# EAGLE schematic cpu (EAGLE 7.6.0)
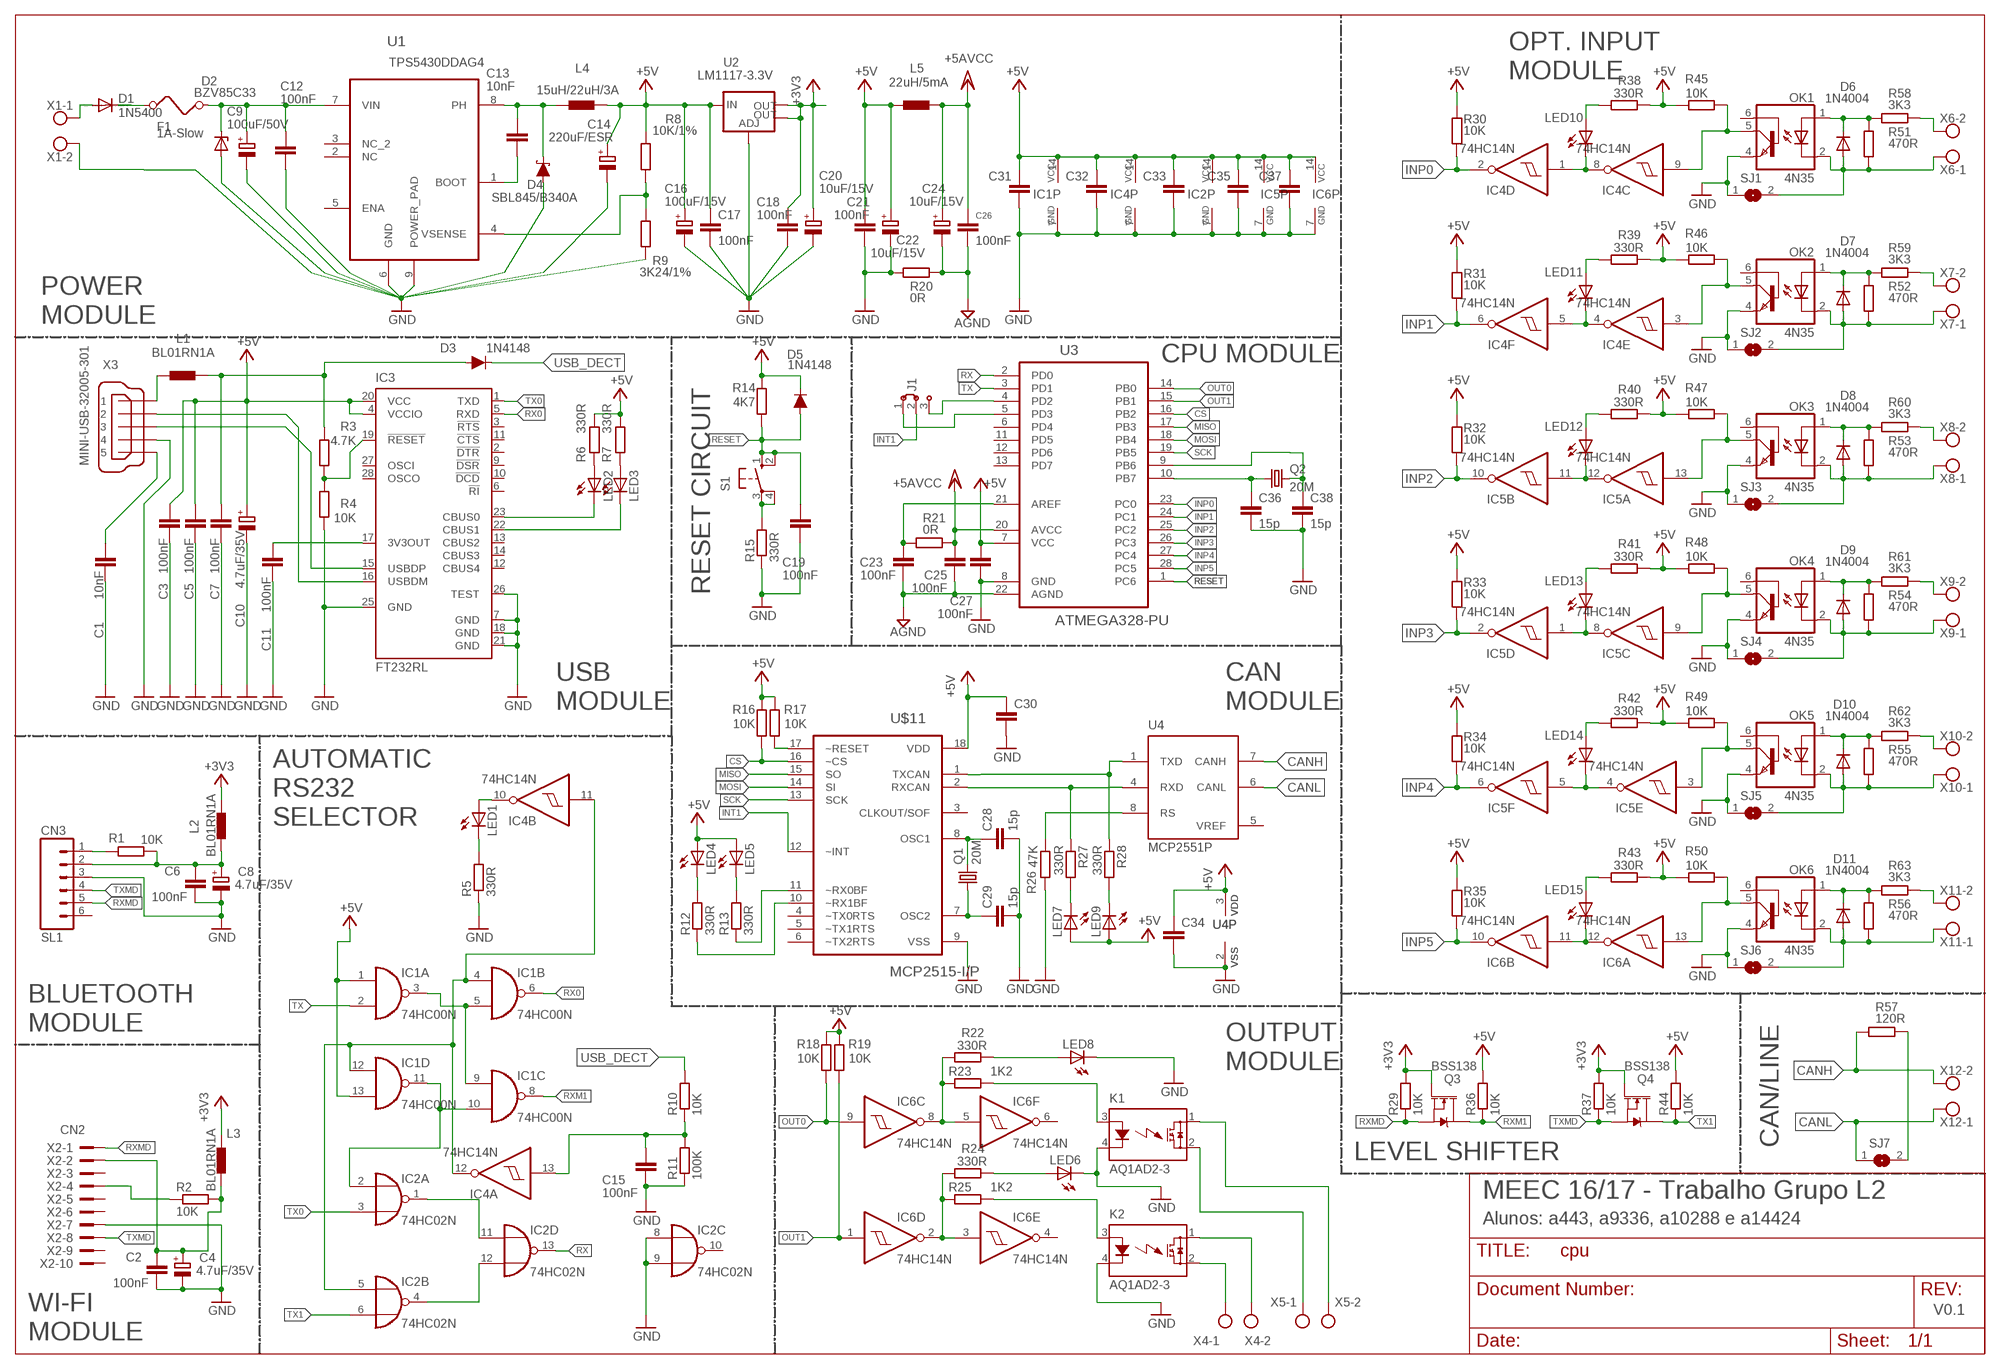
[diagram p0: schematic, sheet 1]

## Parts
C1  10nF  C-EUC0805  [C0805]
C2  100nF  C-EUC0805  [C0805]
C3  100nF  C-EUC0805  [C0805]
C4  4.7uF/35V  CPOL-EUE5-10.5  [E5-10,5]
C5  100nF  C-EUC0805  [C0805]
C6  100nF  C-EUC0805  [C0805]
C7  100nF  C-EUC0805  [C0805]
C8  4.7uF/35V  CPOL-EUE5-10.5  [E5-10,5]
C9  100uF/50V  CPOL-EUE5-10.5  [E5-10,5]
C10  4.7uF/35V  CPOL-EUE5-10.5  [E5-10,5]
C11  100nF  C-EUC0805  [C0805]
C12  100nF  C-EUC0805  [C0805]
C13  10nF  C-EUC0805  [C0805]
C14  220uF/ESR  CPOL-EUE5-10.5  [E5-10,5]
C15  100nF  C-EUC0805  [C0805]
C16  100uF/15V  CPOL-EUE5-10.5  [E5-10,5]
C17  100nF  C-EUC0805  [C0805]
C18  100nF  C-EUC0805  [C0805]
C19  100nF  C-EUC0805  [C0805]
C20  10uF/15V  CPOL-EUE5-10.5  [E5-10,5]
C21  100nF  C-EUC0805  [C0805]
C22  10uF/15V  CPOL-EUE5-10.5  [E5-10,5]
C23  100nF  C-EUC0805  [C0805]
C24  10uF/15V  CPOL-EUE5-10.5  [E5-10,5]
C25  100nF  C-EUC0805  [C0805]
C26  100nF  C-EUC0805  [C0805]
C27  100nF  C-EUC0805  [C0805]
C28  15p  C-EU025-024X044  [C025-024X044]
C29  15p  C-EU025-024X044  [C025-024X044]
C30  C-EUC0805  [C0805]
C31  C-EUC0805  [C0805]
C32  C-EUC0805  [C0805]
C33  C-EUC0805  [C0805]
C34  C-EUC0805  [C0805]
C35  C-EUC0805  [C0805]
C36  15p  C-EU025-024X044  [C025-024X044]
C37  C-EUC0805  [C0805]
C38  15p  C-EU025-024X044  [C025-024X044]
D1  1N5400  [DO201-15]
D2  BZV85C33  ZENER-DIODEF126-10  [F126Z10]
D3  1N4148  DIODE-1N4148  [DIODE-1N4148]
D4  SBL845/B340A  DIODE-SCHOTTKY-B340A  [SMA-DIODE]
D5  1N4148  DIODE-1N4148  [DIODE-1N4148]
D6  1N4004  [DO41-10]
D7  1N4004  [DO41-10]
D8  1N4004  [DO41-10]
D9  1N4004  [DO41-10]
D10  1N4004  [DO41-10]
D11  1N4004  [DO41-10]
F1  1A-Slow  FUSE  [FUSE]
IC1  74HC00N  [DIL14]
IC2  74HC02N  [DIL14]
IC3  FT232RL  [SSOP28]
IC4  74HC14N  [DIL14]
IC5  74HC14N  [DIL14]
IC6  74HC14N  [DIL14]
J1  J2X2MM  [04C]
K1  AQ1AD2-3  [AQ1]
K2  AQ1AD2-3  [AQ1]
L1  BL01RN1A  [BL01RN1A]
L2  BL01RN1A  [BL01RN1A]
L3  BL01RN1A  [BL01RN1A]
L4  15uH/22uH/3A  DR1030  [DR1030]
L5  22uH/5mA  BL01RN1A  [BL01RN1A]
LED1  LED3MM  [LED3MM]
LED2  LED3MM  [LED3MM]
LED3  LED3MM  [LED3MM]
LED4  LED3MM  [LED3MM]
LED5  LED3MM  [LED3MM]
LED6  LED3MM  [LED3MM]
LED7  LED3MM  [LED3MM]
LED8  LED3MM  [LED3MM]
LED9  LED3MM  [LED3MM]
LED10  LED3MM  [LED3MM]
LED11  LED3MM  [LED3MM]
LED12  LED3MM  [LED3MM]
LED13  LED3MM  [LED3MM]
LED14  LED3MM  [LED3MM]
LED15  LED3MM  [LED3MM]
OK1  4N35  [DIL06]
OK2  4N35  [DIL06]
OK3  4N35  [DIL06]
OK4  4N35  [DIL06]
OK5  4N35  [DIL06]
OK6  4N35  [DIL06]
Q1  20M  CRYSTALHC49S  [HC49/S]
Q2  20M  CRYSTALHC49S  [HC49/S]
Q3  BSS138  MOSFET-NCH-BSS138  [SOT23-3]
Q4  BSS138  MOSFET-NCH-BSS138  [SOT23-3]
R1  10K  R-EU_R0603  [R0603]
R2  10K  R-EU_R0603  [R0603]
R3  4.7K  R-EU_R0603  [R0603]
R4  10K  R-EU_R0603  [R0603]
R5  330R  R-EU_R0603  [R0603]
R6  330R  R-EU_R0603  [R0603]
R7  330R  R-EU_R0603  [R0603]
R8  10K/1%  R-EU_R0603  [R0603]
R9  3K24/1%  R-EU_R0603  [R0603]
R10  10K  R-EU_R0603  [R0603]
R11  100K  R-EU_R0603  [R0603]
R12  330R  R-EU_R0603  [R0603]
R13  330R  R-EU_R0603  [R0603]
R14  4K7  R-EU_R0603  [R0603]
R15  330R  R-EU_R0603  [R0603]
R16  10K  R-EU_R0603  [R0603]
R17  10K  R-EU_R0603  [R0603]
R18  10K  R-EU_R0603  [R0603]
R19  10K  R-EU_R0603  [R0603]
R20  0R  R-EU_R0603  [R0603]
R21  0R  R-EU_R0603  [R0603]
R22  330R  R-EU_R0603  [R0603]
R23  1K2  R-EU_R0603  [R0603]
R24  330R  R-EU_R0603  [R0603]
R25  1K2  R-EU_R0603  [R0603]
R26  47K  R-EU_R0603  [R0603]
R27  330R  R-EU_R0603  [R0603]
R28  330R  R-EU_R0603  [R0603]
R29  10K  R-EU_R0603  [R0603]
R30  10K  R-EU_R0603  [R0603]
R31  10K  R-EU_R0603  [R0603]
R32  10K  R-EU_R0603  [R0603]
R33  10K  R-EU_R0603  [R0603]
R34  10K  R-EU_R0603  [R0603]
R35  10K  R-EU_R0603  [R0603]
R36  10K  R-EU_R0603  [R0603]
R37  10K  R-EU_R0603  [R0603]
R38  330R  R-EU_R0603  [R0603]
R39  330R  R-EU_R0603  [R0603]
R40  330R  R-EU_R0603  [R0603]
R41  330R  R-EU_R0603  [R0603]
R42  330R  R-EU_R0603  [R0603]
R43  330R  R-EU_R0603  [R0603]
R44  10K  R-EU_R0603  [R0603]
R45  10K  R-EU_R0603  [R0603]
R46  10K  R-EU_R0603  [R0603]
R47  10K  R-EU_R0603  [R0603]
R48  10K  R-EU_R0603  [R0603]
R49  10K  R-EU_R0603  [R0603]
R50  10K  R-EU_R0603  [R0603]
R51  470R  R-EU_R0603  [R0603]
R52  470R  R-EU_R0603  [R0603]
R53  470R  R-EU_R0603  [R0603]
R54  470R  R-EU_R0603  [R0603]
R55  470R  R-EU_R0603  [R0603]
R56  470R  R-EU_R0603  [R0603]
R57  120R  R-EU_R0603  [R0603]
R58  3K3  R-EU_R0603  [R0603]
R59  3K3  R-EU_R0603  [R0603]
R60  3K3  R-EU_R0603  [R0603]
R61  3K3  R-EU_R0603  [R0603]
R62  3K3  R-EU_R0603  [R0603]
R63  3K3  R-EU_R0603  [R0603]
S1  10-XX  [B3F-10XX]
SJ1  SJ  [SJ]
SJ2  SJ  [SJ]
SJ3  SJ  [SJ]
SJ4  SJ  [SJ]
SJ5  SJ  [SJ]
SJ6  SJ  [SJ]
SJ7  SJ  [SJ]
SL1  CN3  M06  [06P]
U1  TPS5430DDAG4  [SOIC127P600X170-9N]
U2  LM1117-3.3V  V_REG_LM1117SOT223  [SOT223]
U3  ATMEGA328-PU  [DIP254P762X406-28P]
U4  MCP2551P  [DIL8]
U$11  MCP2515-I/P  [DIP254P762X432-18]
X1  AK300/2  [AK300/2]
X2  CN2  2510-  [PAK100/2500-10]
X3  MINI-USB-32005-301  [32005-301]
X4  AK300/2  [AK300/2]
X5  AK300/2  [AK300/2]
X6  AK300/2  [AK300/2]
X7  AK300/2  [AK300/2]
X8  AK300/2  [AK300/2]
X9  AK300/2  [AK300/2]
X10  AK300/2  [AK300/2]
X11  AK300/2  [AK300/2]
X12  AK300/2  [AK300/2]

## Nets
+3V3: C18.1 C20.+ L2.2 L3.2 Q3.1(G) Q4.1(G) R29.2 R37.2 U2.2(OUT) U2.4(OUT)
+5V: C3.1 C5.1 C10.+ C14.+ C16.+ C17.1 C21.1 C22.+ C27.1 C30.1 C31.1 C32.1 C33.1 C34.1 C35.1 C37.1 D5.C IC1.1(A:I0) IC1.13(D:I1) IC1.14(P:VCC) IC2.14(P:VCC) IC3.4(VCCIO) IC3.20(VCC) IC4.14(P:VCC) IC5.14(P:VCC) IC6.14(P:VCC) L4.2 L5.1 LED4.A LED5.A LED7.A LED9.A R6.2 R7.2 R8.1 R14.2 R16.2 R17.2 R18.2 R19.2 R30.1 R31.1 R32.1 R33.1 R34.1 R35.1 R36.2 R38.1 R39.1 R40.1 R41.1 R42.1 R43.1 R44.2 R45.1 R46.1 R47.1 R48.1 R49.1 R50.1 U2.3(IN) U3.7(VCC) U4.3(VDD) U$11.18(VDD)
AGND: C23.2 C24.- C25.2 C26.2 R20.2 U3.22(AGND)
AVCC: C25.1 R21.2 U3.20(AVCC) ; supply symbol labelled +5AVCC
CANH: R57.1 U4.7(CANH) X12.2
CANL: SJ7.1 U4.6(CANL) X12.1
CS: R16.1 U3.16(PB2) U$11.16(~CS)
GND: C1.2 C2.2 C3.2 C4.- C5.2 C6.2 C7.2 C8.- C9.- C10.- C11.2 C12.2 C14.- C15.2 C16.- C17.2 C18.2 C19.2 C20.- C21.2 C22.- C27.2 C28.2 C29.2 C30.2 C31.2 C32.2 C33.2 C34.2 C35.2 C36.2 C37.2 C38.2 D2.A D4.A IC1.7(P:GND) IC2.7(P:GND) IC2.8(C:I0) IC2.9(C:I1) IC3.7(GND) IC3.18(GND) IC3.21(GND) IC3.25(GND) IC3.26(TEST) IC4.7(P:GND) IC5.7(P:GND) IC6.7(P:GND) K1.4(K) K2.4(K) LED6.K(C) LED8.K(C) OK1.4(EMI) OK2.4(EMI) OK3.4(EMI) OK4.4(EMI) OK5.4(EMI) OK6.4(EMI) R4.1 R5.1 R9.2 R11.1 R15.1 R20.1 R26.2 SJ1.1 SJ2.1 SJ3.1 SJ4.1 SJ5.1 SJ6.1 SL1.3 U1.6(GND) U1.9(POWER_PAD) U2.1(ADJ) U3.8(GND) U4.2(VSS) U$11.9(VSS) X1.2 X2.7 X3.4
INP0: IC4.2(D:O) R30.2 U3.23(PC0)
INP1: IC4.6(F:O) R31.2 U3.24(PC1)
INP2: IC5.10(B:O) R32.2 U3.25(PC2)
INP3: IC5.2(D:O) R33.2 U3.26(PC3)
INP4: IC5.6(F:O) R34.2 U3.27(PC4)
INP5: IC6.10(B:O) R35.2 U3.28(PC5)
INT1: J1.2 U$11.12(~INT)
MISO: U3.17(PB3) U$11.15(SO)
MOSI: U3.18(PB4) U$11.14(SI)
N$1: C9.+ C12.1 D2.C F1.2 U1.7(VIN)
N$2: D1.C F1.1
N$3: C13.1 D4.C L4.1 U1.8(PH)
N$4: C13.2 U1.1(BOOT)
N$5: C36.1 Q2.1 U3.10(PB7)
N$6: C11.1 IC3.17(3V3OUT)
N$7: R8.2 R9.1 U1.4(VSENSE)
N$8: C15.1 IC4.13(A:I) R10.1 R11.2
N$9: IC3.15(USBDP) X3.3
N$10: LED3.A R7.1
N$11: IC3.19(!RESET) R3.1 R4.2
N$12: C7.1 D3.A L1.2 R3.2
N$13: IC3.16(USBDM) X3.2
N$14: IC2.1(A:O) IC2.11(D:I0)
N$15: L1.1 X3.1
N$16: R57.2 SJ7.2
N$17: IC4.10(B:O) LED1.A
N$18: IC2.4(B:O) IC2.12(D:I1)
N$19: IC1.3(A:O) IC1.5(B:I1) IC1.9(C:I0)
N$20: LED1.K(C) R5.2
N$21: C1.1 X3.5
N$22: LED2.A R6.1
N$23: IC1.10(C:I1) IC1.11(D:O) IC2.2(A:I0)
N$24: IC3.23(CBUS0) LED2.K(C)
N$25: IC3.22(CBUS1) LED3.K(C)
N$26: R13.1 U$11.11(~RX0BF)
N$27: C28.1 Q1.2 U$11.8(OSC1)
N$28: R2.1 X2.4
N$29: R12.1 U$11.10(~RX1BF)
N$30: R15.2 S1.3(P) S1.4(P1)
N$31: R27.1 U4.4(RXD) U$11.2(RXCAN)
N$32: J1.3 U3.4(PD2)
N$33: J1.1 U3.5(PD3)
N$34: C23.1 R21.1 U3.21(AREF)
N$35: D6.C OK1.1(A) R51.1 R58.1
N$36: R26.1 U4.8(RS)
N$37: LED11.A R39.2
N$38: R28.1 U4.1(TXD) U$11.1(TXCAN)
N$39: LED9.K(C) R28.2
N$40: LED7.K(C) R27.2
N$41: LED10.A R38.2
N$42: IC4.1(D:I) IC4.8(C:O) LED10.K(C)
N$43: IC4.4(E:O) IC4.5(F:I) LED11.K(C)
N$44: C2.1 C4.+ L3.1 R2.2 X2.2
N$45: D7.C OK2.1(A) R52.1 R59.1
N$46: IC4.3(E:I) OK2.5(COL) R46.2
N$47: R59.2 X7.2
N$48: C29.1 Q1.1 U$11.7(OSC2)
N$49: LED4.K(C) R12.2
N$50: LED5.K(C) R13.2
N$51: D7.A OK2.2(C) R52.2 SJ2.2 X7.1
N$52: IC4.9(C:I) OK1.5(COL) R45.2
N$53: IC5.4(E:O) IC5.5(F:I) LED14.K(C)
N$54: LED12.A R40.2
N$55: IC5.11(B:I) IC5.12(A:O) LED12.K(C)
N$56: C6.1 C8.+ L2.1 R1.1 SL1.2
N$57: D8.C OK3.1(A) R53.1 R60.1
N$58: IC5.13(A:I) OK3.5(COL) R47.2
N$59: R60.2 X8.2
N$60: D8.A OK3.2(C) R53.2 SJ3.2 X8.1
N$61: LED13.A R41.2
N$62: IC5.1(D:I) IC5.8(C:O) LED13.K(C)
N$63: IC6.5(F:I) IC6.8(C:O) R22.2 R23.2
N$64: D9.C OK4.1(A) R54.1 R61.1
N$65: IC5.9(C:I) OK4.5(COL) R48.2
N$66: R61.2 X9.2
N$67: D9.A OK4.2(C) R54.2 SJ4.2 X9.1
N$68: LED14.A R42.2
N$69: IC6.2(D:O) IC6.3(E:I) R24.2 R25.2
N$70: R1.2 SL1.1
N$71: D10.C OK5.1(A) R55.1 R62.1
N$72: IC5.3(E:I) OK5.5(COL) R49.2
N$73: R62.2 X10.2
N$74: D10.A OK5.2(C) R55.2 SJ5.2 X10.1
N$75: LED15.A R43.2
N$76: IC6.11(B:I) IC6.12(A:O) LED15.K(C)
N$77: K2.3(A) R25.1
N$78: D11.C OK6.1(A) R56.1 R63.1
N$79: R58.2 X6.2
N$80: D6.A OK1.2(C) R51.2 SJ1.2 X6.1
N$81: IC6.13(A:I) OK6.5(COL) R50.2
N$82: R63.2 X11.2
N$83: D11.A OK6.2(C) R56.2 SJ6.2 X11.1
N$84: IC1.4(B:I0) IC1.12(D:I0) IC2.5(B:I0) IC4.11(B:I) IC4.12(A:O)
N$85: K1.3(A) R23.1
N$86: LED8.A R22.1
N$87: D1.A X1.1
N$89: LED6.A R24.1
N$92: K2.2(DS2) X4.1
N$93: K2.1(DS1) X4.2
N$94: K1.2(DS2) X5.1
N$95: K1.1(DS1) X5.2
OUT0: IC6.9(C:I) R18.1 U3.14(PB0)
OUT1: IC6.1(D:I) R19.1 U3.15(PB1)
RESET: C19.1 D5.A R14.1 S1.1(S) S1.2(S1) U3.1(PC6)
RESET1: R17.1 U$11.17(~RESET)
RX: IC2.13(D:O) U3.2(PD0)
RX0: IC1.6(B:O) IC3.5(RXD)
RXM1: IC1.8(C:O) Q3.3(D) R36.1
RXMD: Q3.2(S) R29.1 SL1.5 X2.1
SCK: C38.1 Q2.2 U3.9(PB6) U3.19(PB5) U$11.13(SCK)
TX: IC1.2(A:I1) U3.3(PD1)
TX0: IC2.3(A:I1) IC3.1(TXD)
TX1: IC2.6(B:I1) Q4.3(D) R44.1
TXMD: Q4.2(S) R37.1 SL1.4 X2.8
USB_DECT: D3.C R10.2
VCC/2: C24.+ C26.1 L5.2 ; supply symbol labelled +5AVCC
Unconnected: IC2.10(C:O) IC3.2(!DTR) IC3.3(!RTS) IC3.6(!RI) IC3.9(!DSR) IC3.10(!DCD) IC3.11(!CTS) IC3.12(CBUS4) IC3.13(CBUS2) IC3.14(CBUS3) IC3.27(OSCI) IC3.28(OSCO) IC6.4(E:O) IC6.6(F:O) OK1.6(BAS) OK2.6(BAS) OK3.6(BAS) OK4.6(BAS) OK5.6(BAS) OK6.6(BAS) SL1.6 U1.2(NC) U1.3(NC_2) U1.5(ENA) U3.6(PD4) U3.11(PD5) U3.12(PD6) U3.13(PD7) U$11.3(CLKOUT/SOF) U$11.4(~TX0RTS) U$11.5(~TX1RTS) U$11.6(~TX2RTS) X2.3 X2.5 X2.6 X2.9 X2.10

## Notes on the sheet
- OPT. INPUT
  MODULE
- POWER
  MODULE
- CPU MODULE
- RESET CIRCUIT
- USB
  MODULE
- CAN
  MODULE
- AUTOMATIC
  RS232
  SELECTOR
- BLUETOOTH
  MODULE
- OUTPUT
  MODULE
- CAN/LINE
- LEVEL SHIFTER
- MEEC 16/17 - Trabalho Grupo L2
- Alunos: a443, a9336, a10288 e a14424
- V0.1
- WI-FI
  MODULE

## Power pins joined to a net without a drawn wire
VREF: U4.5(VREF)

## Library data of the parts
C1-C3 C5-C7 C11-C13 C15 C17-C19 C21 C23 C25-C38 = rcl:C-EU: CAPACITOR, European symbol
C4 C8-C10 C14 C16 C20 C22 C24 = rcl:CPOL-EU: POLARIZED CAPACITOR, European symbol
D1 = diode:1N5400: DIODE standard rectifier, 3 A, 50 V (Motorola)
D2 = diode:ZENER-DIODE: Z-Diode
D3 D5 = SparkFun-DiscreteSemi:DIODE: Diode These are standard reverse protection diodes and small signal diodes. SparkFun Products: SparkFun SparkPunk Sound Kit <https://www.sparkfun.com/products/11177> SparkFun ESP8266 Thing <https://www.sparkfun.com/products/13231>; PROD_ID: DIO-08378; VALUE: 200mA/100V/1V
D4 = SparkFun-DiscreteSemi:DIODE-SCHOTTKY: Schottky diode A Schottky diode is a semiconductor diode which has a low forward voltage drop and a very fast switching action.; PROD_ID: DIO-09886; VALUE: 3A/40V/500mV
D6-D11 = diode:1N4004: DIODE general purpose rectifier, 1 A
F1 = special:FUSE: FUSE 5 x 20 mm
IC1 = 74xx-eu:74*00: Quad 2-input NAND gate
IC2 = 74xx-eu:74*02: Quad 2-input NOR gate
IC3 = ftdichip:FT232R: Source: http://www.ftdichip.com/Documents/DataSheets/DS_FT232R_v104.pdf; MPN: FT232RL; OC_FARNELL: 1146032; OC_NEWARK: 91K9918
IC4-IC6 = 74xx-eu:74*14: Hex schmitt trigger INVERTER
J1 = jumper:J2: Jumper switch 2 x 2.5 mm
K1 K2 = relay:AQ*: SOLID STATE RELAY NAiS Source: http://www.mew-europe.com/.. en_ds_61601_0000.pdf; MF: AROMAT/ MATSUSHITA; MPN: AQ1AD2-3/28VDC; OC_FARNELL: unknown; OC_NEWARK: 10C4052
L1-L3 L5 = inductors:BL0: Noise Suppression Products/EMI Suppression Filters, Lead EMIFIL(R) Inductor Type Source: http://www.murata.com .. BL01RN1_DS.pdf
L4 = inductors:DR1030: DR1030 Series Low Profile Power Inductors Source: Data sheet <http://www.cooperbussmann.com/pdf/c73e479f-f867-4c64-ae26-9c1f23814163.pdf>
LED1-LED15 = led:LED: LED OSRAM: - CHIPLED LG R971, LG N971, LY N971, LG Q971, LY Q971, LO R971, LY R971 LH N974, LH R974 LS Q976, LO Q976, LY Q976 LO Q996 - Hyper CHIPLED LW Q18S LB Q993, LB Q99A, LB R99A - SideLED LS A670, LO A670, LY A670, LG A670, LP A670 LB A673, LV A673, LT A673, LW A673 LH A674 LY A675 LS A676, LA A676, LO A676, LY A676, LW A676 LS A679, LY A679, LG A679 - Hyper Micro SIDELED® LS Y876, LA Y876, LO Y876, LY Y876 LT Y87S - SmartLED LW L88C, LW L88S LB L89C, LB L89S, LG L890 LS L89K, LO L89K, LY L89K LS L896, LA L896, LO L896, LY L896 - TOPLED LS T670, LO T670, LY T670, LG T670, LP T670 LSG T670, LSP T670, LSY T670, LOP T670, LYG T670 LG T671, LOG T671, LSG T671 LB T673, LV T673, LT T673, LW T673 LH T674 LS T676, LA T676, LO T676, LY T676, LB T676, LH T676, LSB T676, LW T676 LB T67C, LV T67C, LT T67C, LS T67K, LO T67K, LY T67K, LW E67C LS E67B, LA E67B, LO E67B, LY E67B, LB E67C, LV E67C, LT E67C LW T67C LS T679, LY T679, LG T679 LS T770, LO T770, LY T770, LG T770, LP T770 LB T773, LV T773, LT T773, LW T773 LH T774 LS E675, LA E675, LY E675, LS T675 LS T776, LA T776, LO T776, LY T776, LB T776 LHGB T686 LT T68C, LB T68C - Hyper Mini TOPLED® LB M676 - Mini TOPLED Santana® LG M470 LS M47K, LO M47K, LY M47K Source: http://www.osram.convergy.de LUXEON: - LUMILED® LXK2-PW12-R00, LXK2-PW12-S00, LXK2-PW14-U00, LXK2-PW14-V00 LXK2-PM12-R00, LXK2-PM12-S00, LXK2-PM14-U00 LXK2-PE12-Q00, LXK2-PE12-R00, LXK2-PE12-S00, LXK2-PE14-T00, LXK2-PE14-U00 LXK2-PB12-K00, LXK2-PB12-L00, LXK2-PB12-M00, LXK2-PB14-N00, LXK2-PB14-P00, LXK2-PB14-Q00 LXK2-PR12-L00, LXK2-PR12-M00, LXK2-PR14-Q00, LXK2-PR14-R00 LXK2-PD12-Q00, LXK2-PD12-R00, LXK2-PD12-S00 LXK2-PH12-R00, LXK2-PH12-S00 LXK2-PL12-P00, LXK2-PL12-Q00, LXK2-PL12-R00 Source: www.luxeon.com KINGBRIGHT: KA-3528ASYC Source: www.kingbright.com
OK1-OK6 = optocoupler:4N35: MOTOROLA OPTO COUPLER; MF: FAIRCHILD SEMICONDUCTOR; MPN: 4N35; OC_FARNELL: 1328375; OC_NEWARK: 72K9946
Q1 Q2 = crystal:CRYSTAL: CRYSTAL; OC_FARNELL: 1667008; OC_NEWARK: unknown
Q3 Q4 = SparkFun-DiscreteSemi:MOSFET-NCH: N-channel MOSFETs Voltage controlled devices that allow control of high current outputs. SparkFun Products: SparkFun OpenScale <https://www.sparkfun.com/products/13261> SparkFun Digital Sandbox <https://www.sparkfun.com/products/12651> SparkFun Monster Moto Shield <https://www.sparkfun.com/products/10182> SparkFun MOSFET Power Controller <https://www.sparkfun.com/products/11214>; PROD_ID: TRANS-00830; VALUE: 220mA/50V/3.5Ω
R1-R63 = rcl:R-EU_: RESISTOR, European symbol
S1 = switch-omron:10-XX: OMRON SWITCH; MPN: B3F-1000; OC_FARNELL: 176432; OC_NEWARK: 36M3542
SJ1-SJ7 = jumper:SJ: SMD solder JUMPER
SL1 = con-amp-quick:M06: AMP QUICK CONNECTOR; OC_FARNELL: unknown; OC_NEWARK: unknown
U1 = texas_tps5430:TPS5430DDAG4: 3-A, WIDE INPUT RANGE, STEP-DOWN SWIFT CONVERTER; MPN: TPS5430DDAG4; OC_FARNELL: 1220987; OC_NEWARK: 05M1620; PACKAGE: SOIC-8; SUPPLIER: TEXAS INSTRUMENTS
U2 = SparkFun-IC-Power:V_REG_LM1117: Voltage Regulator LM1117 Standard adjustable voltage regulator but in SMD form. Spark Fun Electronics SKU : COM-00595; PROD_ID: VREG-08170
U3 = mcp2515_dip:ATMEGA328-PU: MCU, 8BIT, AVR, 32K FLASH, 28PDIP; MPN: ATMEGA328-PU; OC_FARNELL: 1972087; OC_NEWARK: 68T2932; PACKAGE: 28PDIP; SUPPLIER: ATMEL
U4 = microchip_can:MCP2551: High Speed CAN tranceiver
U$11 = mcp2515_dip:MCP2515-I/P: Stand-Alone CAN Controller; DESCRIPTION: CAN CONTRL; MPN: MCP2515-I/P; OC_FARNELL: 1439391; OC_NEWARK: 61K2945; PACKAGE: PDIP-18; SUPPLIER: MICROCHIP
X1 X4-X12 = con-ptr500:AK300/2: CONNECTOR; OC_FARNELL: unknown; OC_NEWARK: unknown
X2 = con-3m:2510-: 3M (TM) Pak 100 4-Wall Header Source: 3M; MF: 3M; MPN: 2510-6002UB; OC_FARNELL: 9838244; OC_NEWARK: 46F4725
X3 = con-cypressindustries:MINI-USB-: MINI USB-B Conector Source: www.cypressindustries.com; OC_FARNELL: unknown; OC_NEWARK: unknown

## Module TX1
Ports: 

### Library data of the parts